# EAGLE schematic bbotsv2 (EAGLE 9.6.2)
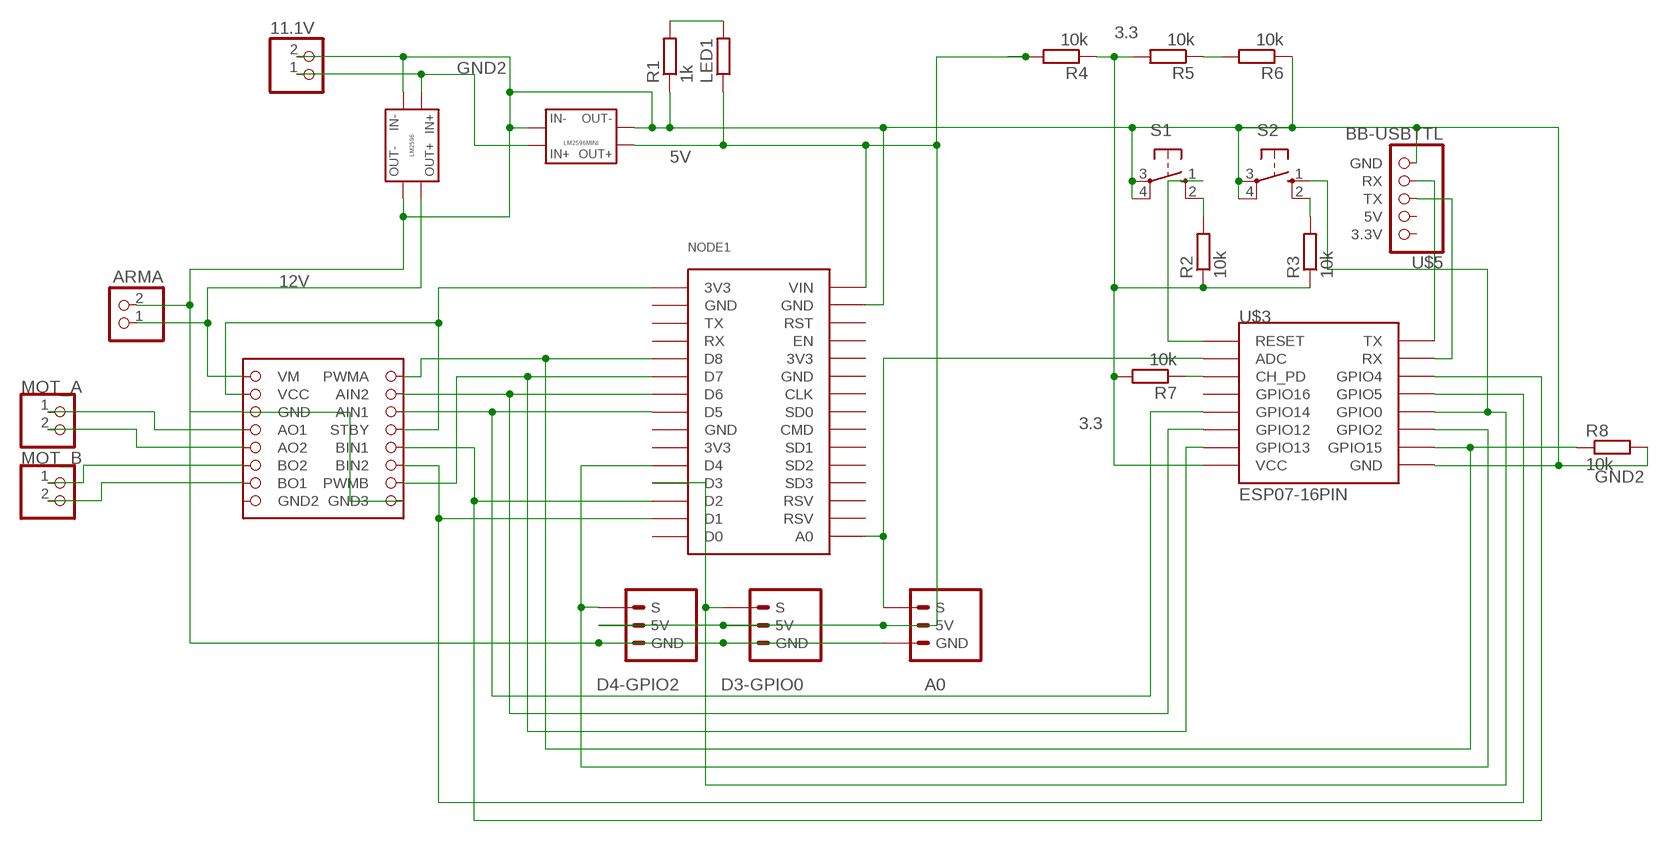
[diagram p0: schematic, sheet 1]

## Parts
11.1V  JST_2PIN-THM  [JST-PH-2-THM]
A0  BB-PIN3  [BB-PIN3]
ARMA  JST_2PIN-THM  [JST-PH-2-THM]
D3-GPIO0  BB-PIN3  [BB-PIN3]
D4-GPIO2  BB-PIN3  [BB-PIN3]
LED1  BB-RESM0805  [M0805]
MOT_A  JST_2PIN-THM  [JST-PH-2-THM]
MOT_B  JST_2PIN-THM  [JST-PH-2-THM]
NODE1  NODEMCU_ESP8266  [NODEMCU_ESP8266]
R1  1k  BB-RESM0805  [M0805]
R2  10k  BB-RESM0805  [M0805]
R3  10k  BB-RESM0805  [M0805]
R4  10k  BB-RESM0805  [M0805]
R5  10k  BB-RESM0805  [M0805]
R6  10k  BB-RESM0805  [M0805]
R7  10k  BB-RESM0805  [M0805]
R8  10k  BB-RESM0805  [M0805]
S1  10-XX  [B3F-10XX]
S2  10-XX  [B3F-10XX]
U$1  BB-LM2596  [BB-LM2596]
U$2  BB-TB6612  [BB-TB6612]
U$3  ESP07-16PIN  [ESP07-16PIN]
U$4  BB-LM2596MINI  [BB-LM2596MINI]
U$5  BB-USBTTL  [1X05]

## Nets
3.3: R2.1 R3.1 R4.1 R5.2 R7.2 U$3.VCC
5V: A0.2(5V) D3-GPIO0.2(5V) D4-GPIO2.2(5V) LED1.1 NODE1.VIN R4.2 U$4.OUT+
12V: ARMA.1 U$1.OUT+ U$2.VM
GND2: 11.1V.2 A0.1(GND) ARMA.2 D3-GPIO0.1(GND) D4-GPIO2.1(GND) NODE1.GND@4(GND) R1.1 R6.1 R8.2 S1.3(P) S1.4(P1) S2.3(P) S2.4(P1) U$1.IN- U$1.OUT- U$2.GND U$2.GND3 U$3.GND U$4.IN- U$4.OUT- U$5.GND
N$1: 11.1V.1 U$1.IN+ U$4.IN+
N$3: LED1.2 R1.2
N$4: NODE1.D8 R8.1 U$2.PWMA U$3.GPIO15
N$5: NODE1.D7 U$2.PWMB U$3.GPIO13
N$7: NODE1.D6 U$2.AI2(AIN2) U$3.GPIO12
N$8: NODE1.D5 U$2.AI1(AIN1) U$3.GPIO14
N$9: NODE1.D2 U$2.BI1(BIN1) U$3.GPIO4
N$10: NODE1.D1 U$2.BI2(BIN2) U$3.GPIO5
N$12: D4-GPIO2.3(S) NODE1.D4 U$3.GPIO2
N$13: MOT_A.2 U$2.AO2
N$14: MOT_A.1 U$2.AO1
N$15: MOT_B.1 U$2.BO2
N$16: MOT_B.2 U$2.BO1
N$17: NODE1.3V3@1(3V3) U$2.STBY U$2.VCC
N$18: D3-GPIO0.3(S) NODE1.D3 S2.1(S) U$3.GPIO0
N$19: U$3.TX U$5.RX
N$20: U$3.RX U$5.TX
N$21: A0.3(S) NODE1.A0 U$3.ADC
N$22: R2.2 S1.2(S1)
N$23: R3.2 S2.2(S1)
N$25: R5.1 R6.2
N$27: S1.1(S) U$3.REST(RESET)
N$28: R7.1 U$3.CH_PD
Unconnected: NODE1.CLK NODE1.CMD NODE1.D0 NODE1.EN NODE1.RST NODE1.RSV1(RSV) NODE1.RSV2(RSV) NODE1.RX NODE1.SD1 NODE1.SD2 NODE1.SD3 NODE1.SDO(SD0) NODE1.TX U$2.GND2 U$3.GPIO16 U$5.3.3V U$5.5V

## Power pins joined to a net without a drawn wire
3V3: NODE1.3V3@2(3V3) NODE1.3V3@3(3V3)
GND: NODE1.GND@1(GND) NODE1.GND@2(GND) NODE1.GND@3(GND)

## Library data of the parts
11.1V ARMA MOT_A MOT_B = adafruit:JST_2PIN: JST 2-Pin Connectors of various flavors SMT-RA (S2B-PH-SM4) 4UConnector #17311 SMT (B2B-PH-SM4) THM-RA (S2B-PH) THM (B2B-PH)
A0 D3-GPIO0 D4-GPIO2 = my-library:BB-PIN3
LED1 R1-R8 = my-library:BB-RES: RESISTOR, European symbol; SPICEPREFIX: R
NODE1 = nodemcu_esp8266:NODEMCU_ESP8266: Node MCU V2 (ESP8266) Created by Harish
S1 S2 = switch-omron:10-XX: OMRON SWITCH; MPN: B3F-1000; OC_FARNELL: 176432; OC_NEWARK: 36M3542
U$1 = my-library:BB-LM2596
U$2 = my-library:BB-TB6612
U$3 = esp8266modules:ESP07-16PIN: ESP8266 Wifi module 07 - 16 pins; DIMENSIONS: 22.0 x 16.0 mm; PINS: 16; PITCH: 0.078" / 2 mm
U$4 = my-library:BB-LM2596MINI
U$5 = my-library:BB-USBTTL